# EAGLE schematic time-decoders (EAGLE 7.7.0)
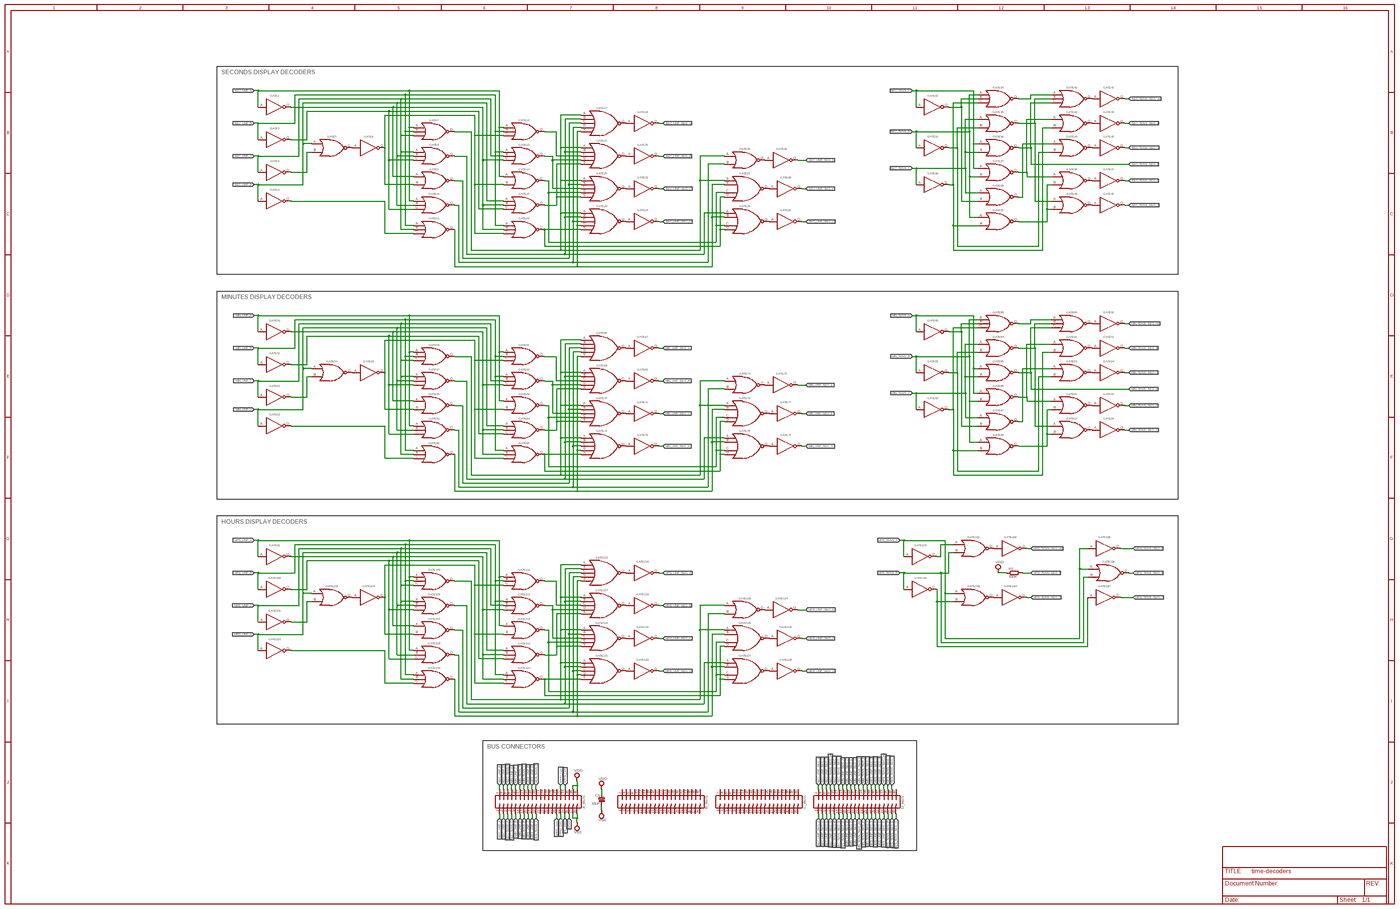
[diagram p0: schematic, sheet 1, overview]
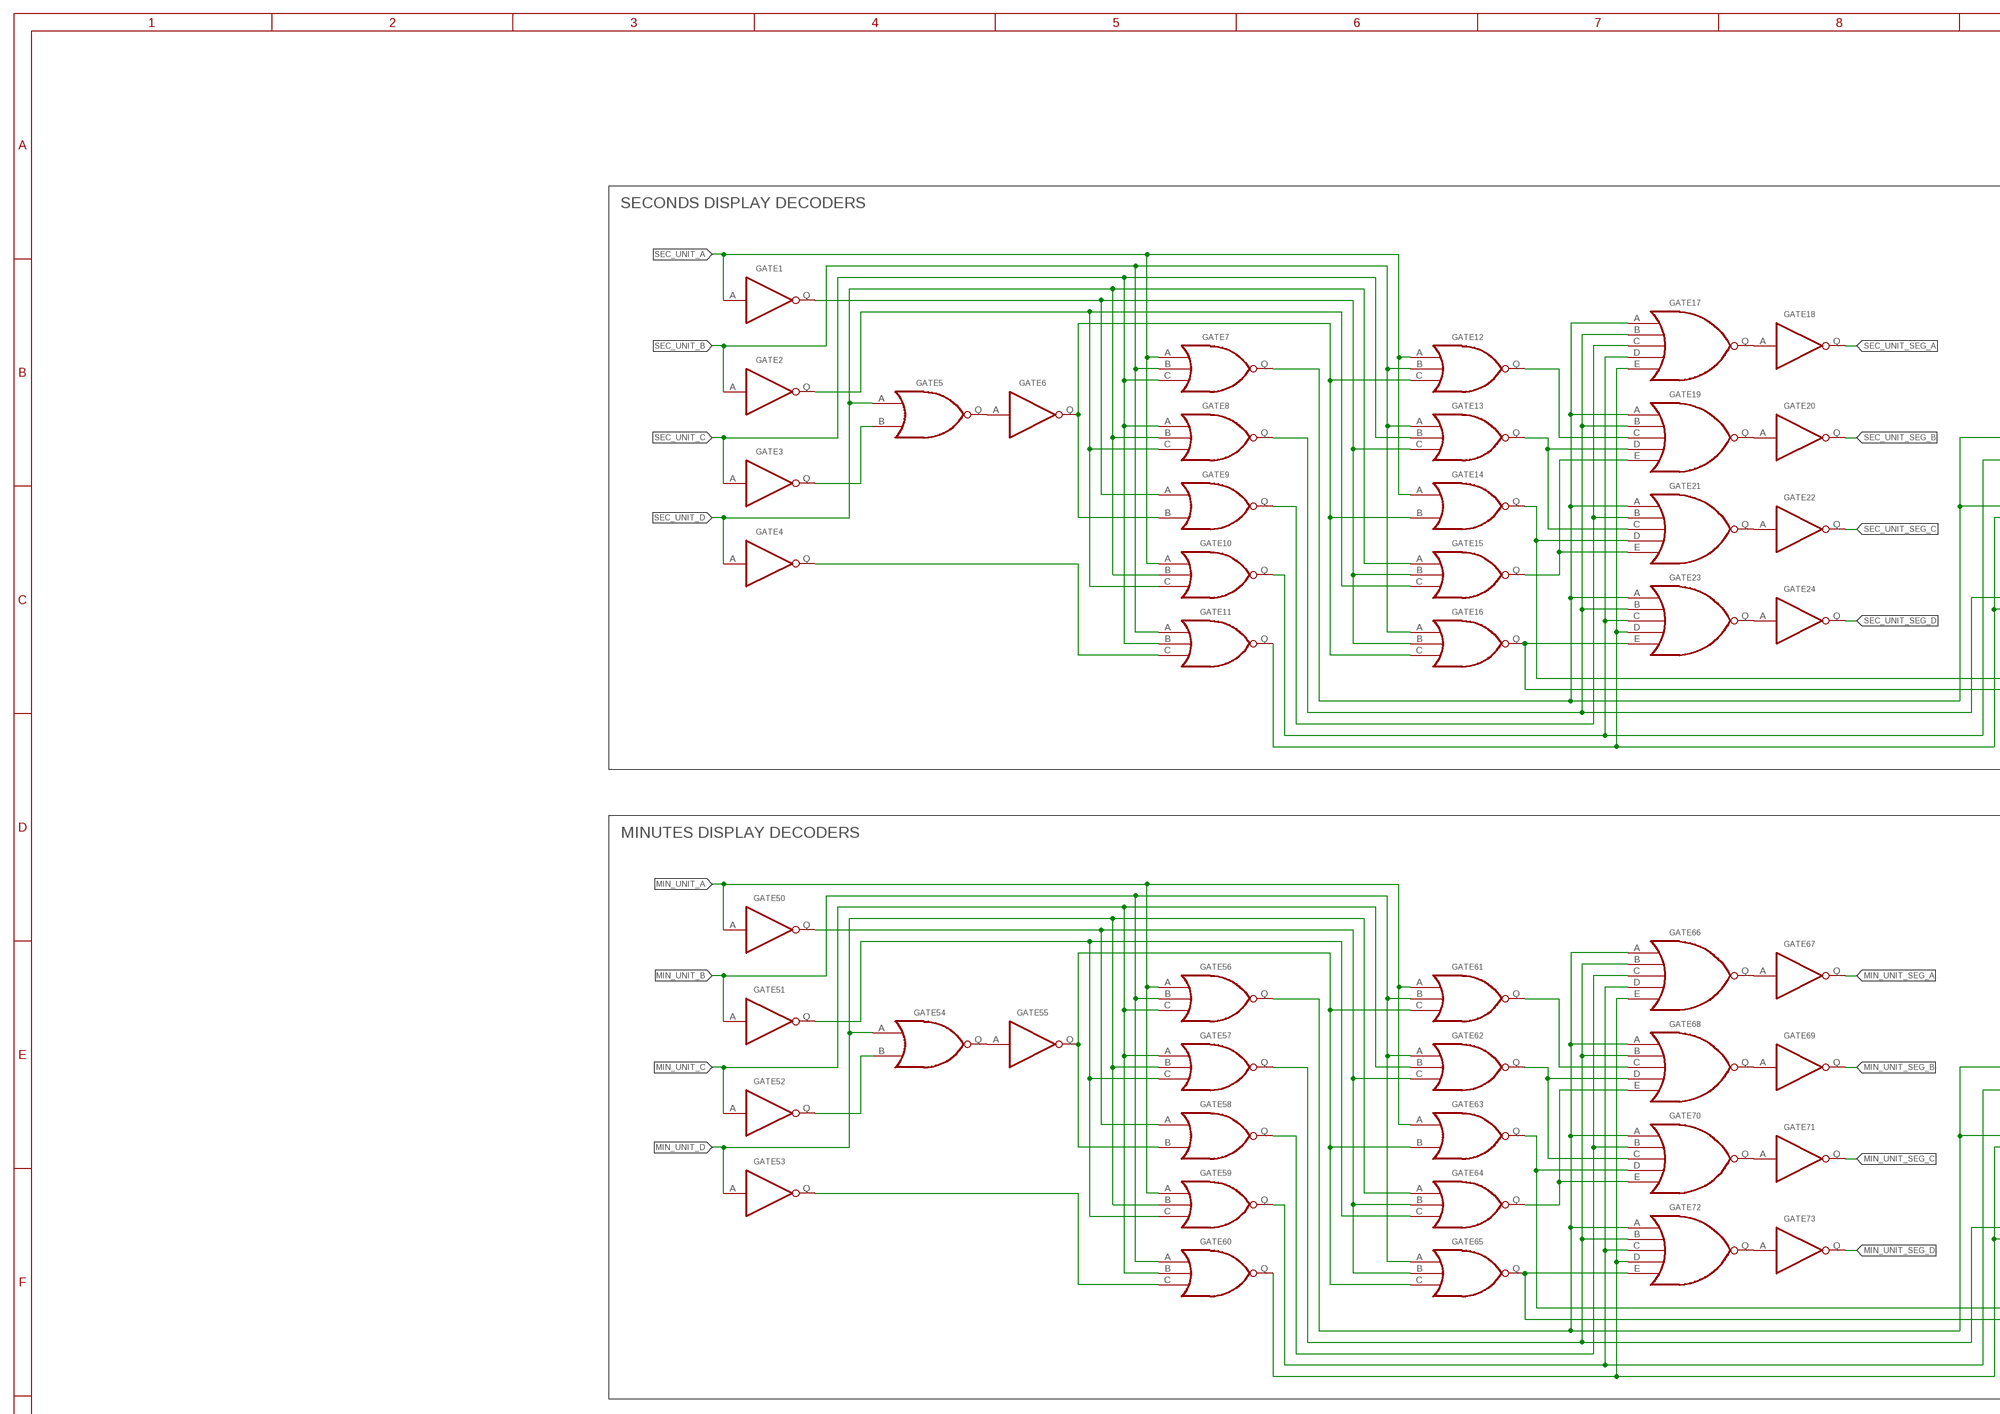
[diagram p1: schematic, sheet 1, part 1 of 4]
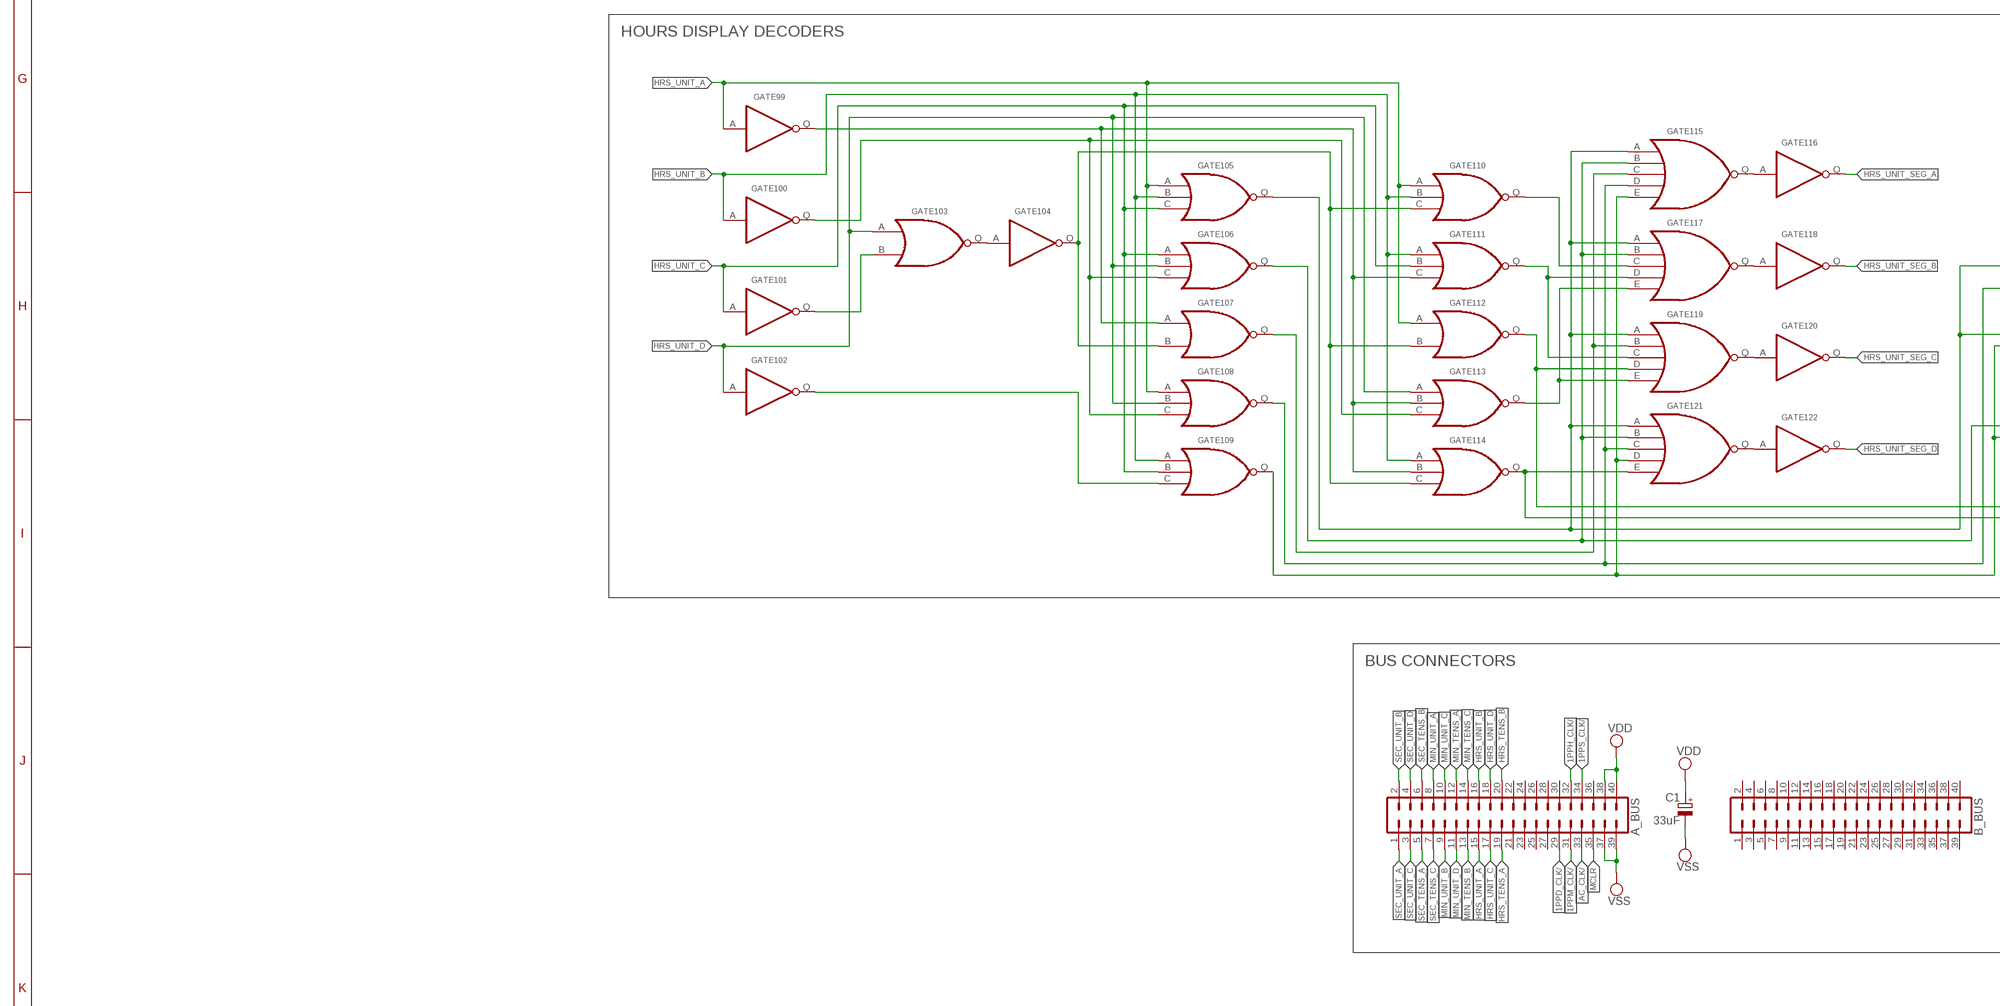
[diagram p2: schematic, sheet 1, part 2 of 4]
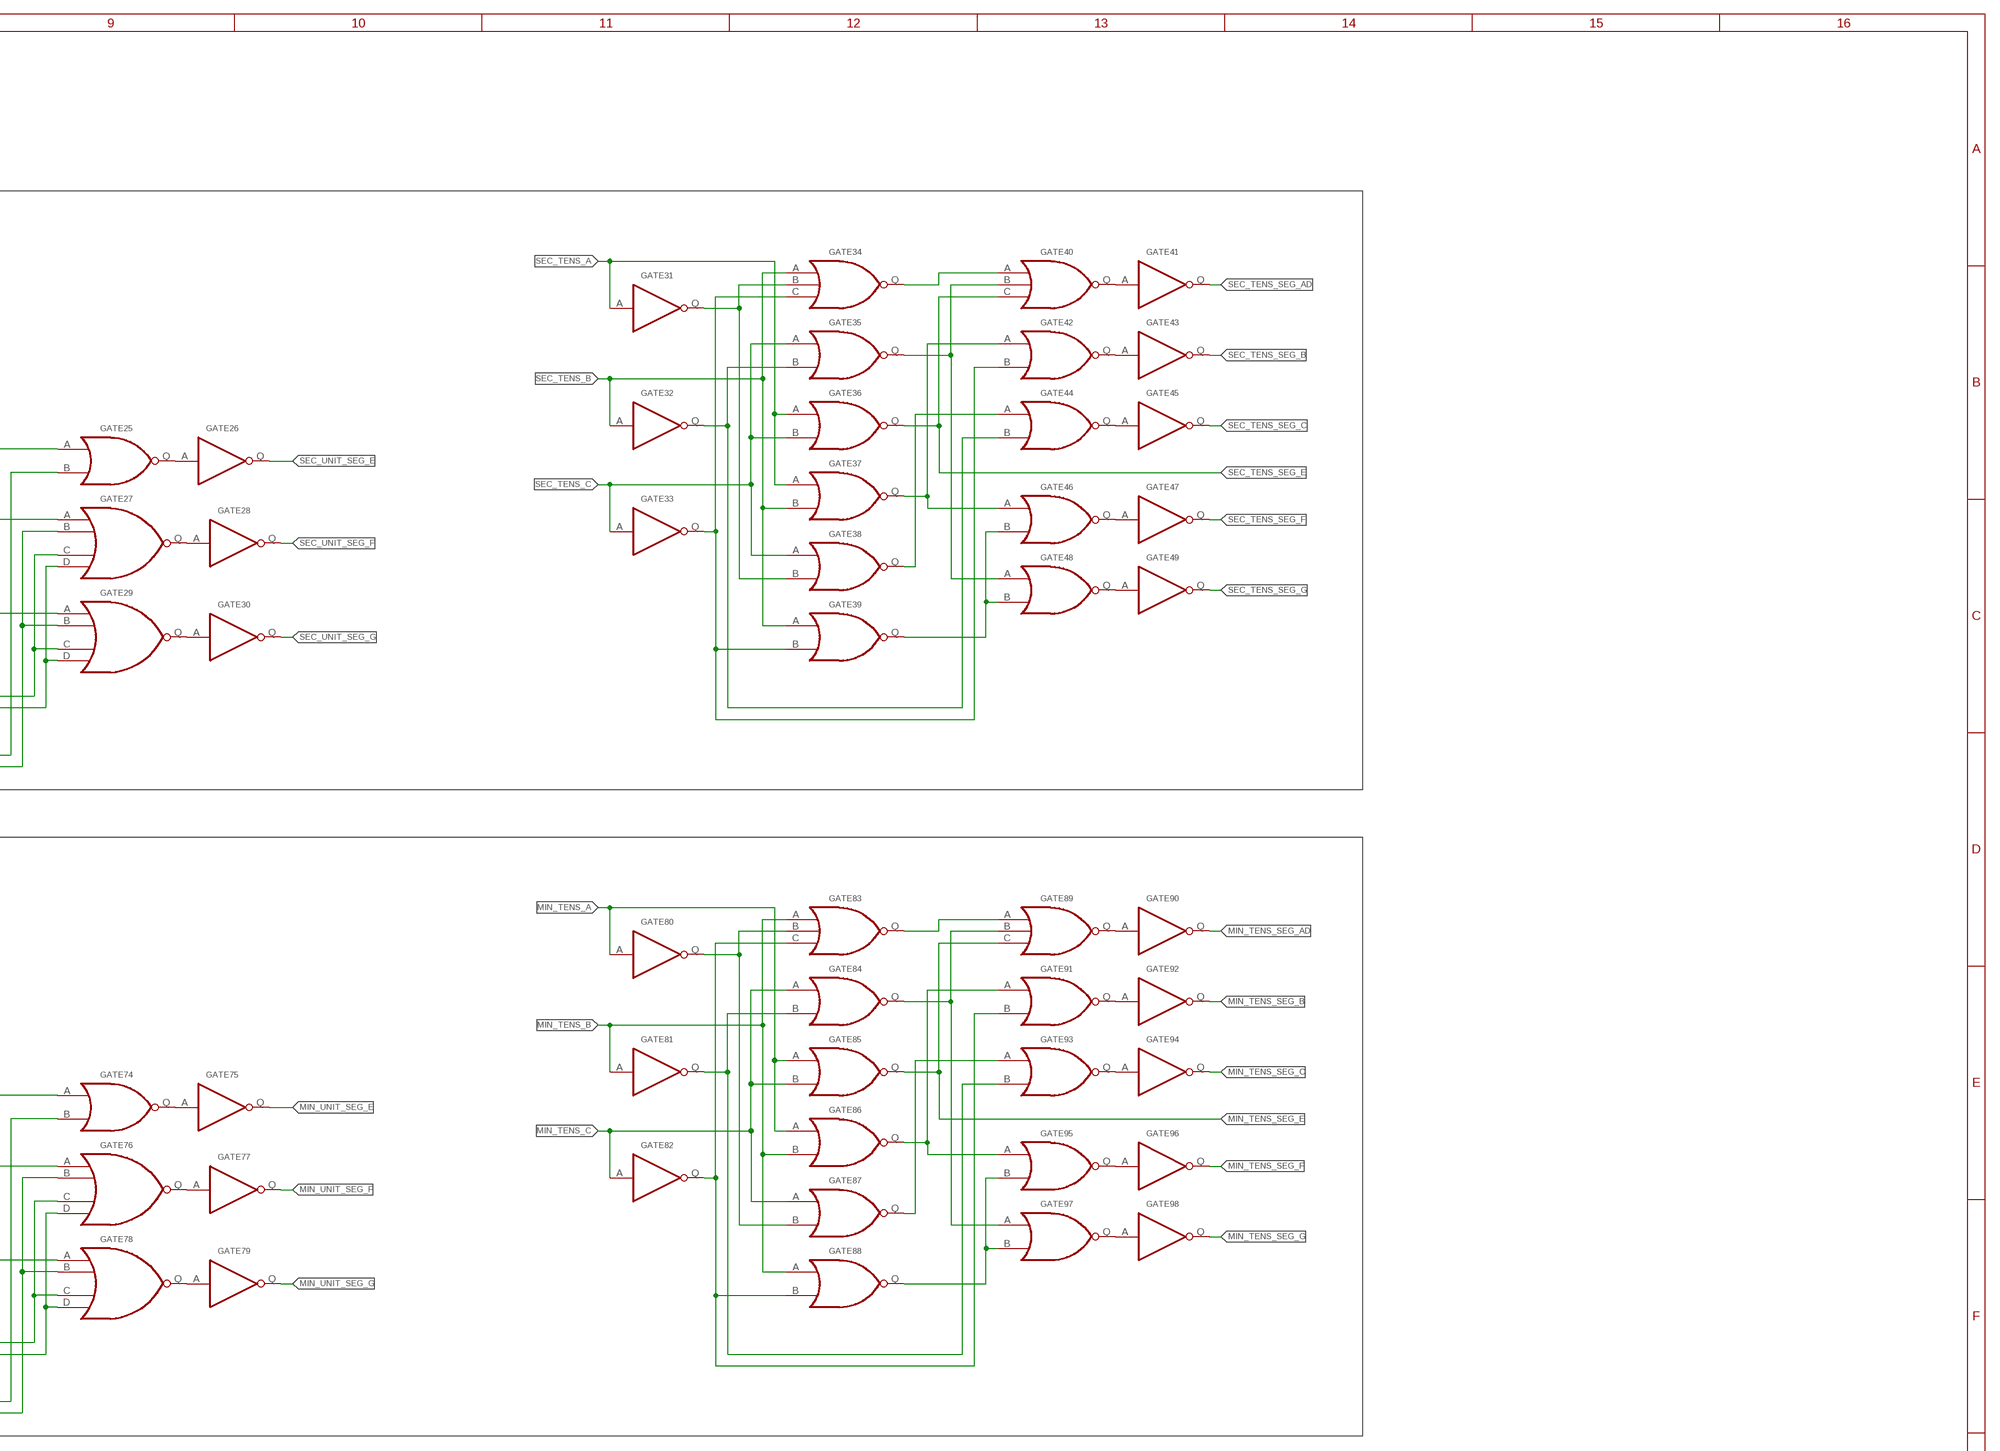
[diagram p3: schematic, sheet 1, part 3 of 4]
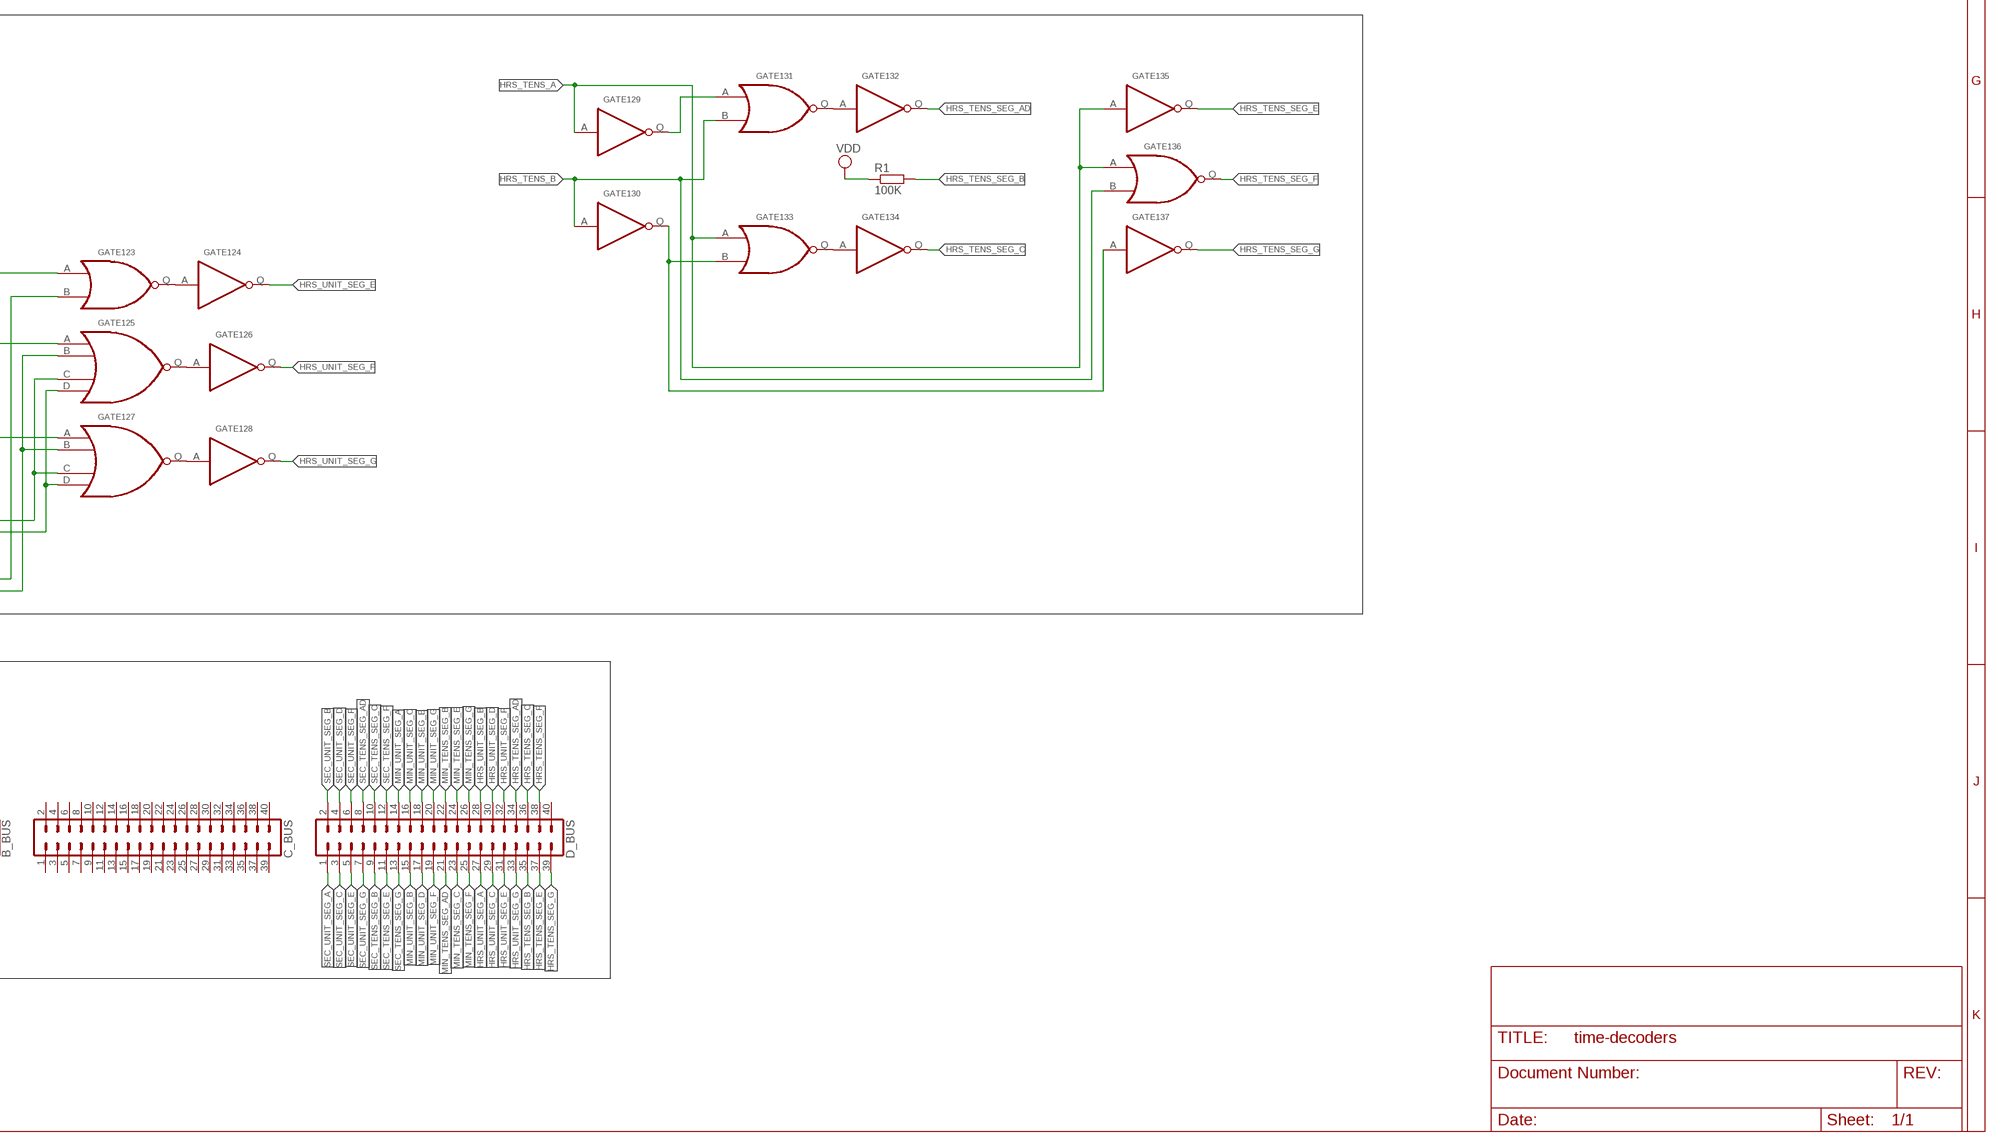
[diagram p4: schematic, sheet 1, part 4 of 4]

## Parts
A_BUS  MA20-2  [MA20-2]
B_BUS  MA20-2  [MA20-2]
C1  33uF  CPOL-EUE2.5-6  [E2,5-6]
C_BUS  MA20-2  [MA20-2]
D_BUS  MA20-2  [MA20-2]
GATE1  INVERTER  [INVERTER]
GATE2  INVERTER  [INVERTER]
GATE3  INVERTER  [INVERTER]
GATE4  INVERTER  [INVERTER]
GATE5  2NOR  [2NOR]
GATE6  INVERTER  [INVERTER]
GATE7  3NOR  [3NOR]
GATE8  3NOR  [3NOR]
GATE9  2NOR  [2NOR]
GATE10  3NOR  [3NOR]
GATE11  3NOR  [3NOR]
GATE12  3NOR  [3NOR]
GATE13  3NOR  [3NOR]
GATE14  2NOR  [2NOR]
GATE15  3NOR  [3NOR]
GATE16  3NOR  [3NOR]
GATE17  5NOR  [5NOR]
GATE18  INVERTER  [INVERTER]
GATE19  5NOR  [5NOR]
GATE20  INVERTER  [INVERTER]
GATE21  5NOR  [5NOR]
GATE22  INVERTER  [INVERTER]
GATE23  5NOR  [5NOR]
GATE24  INVERTER  [INVERTER]
GATE25  2NOR  [2NOR]
GATE26  INVERTER  [INVERTER]
GATE27  4NOR  [4NOR]
GATE28  INVERTER  [INVERTER]
GATE29  4NOR  [4NOR]
GATE30  INVERTER  [INVERTER]
GATE31  INVERTER  [INVERTER]
GATE32  INVERTER  [INVERTER]
GATE33  INVERTER  [INVERTER]
GATE34  3NOR  [3NOR]
GATE35  2NOR  [2NOR]
GATE36  2NOR  [2NOR]
GATE37  2NOR  [2NOR]
GATE38  2NOR  [2NOR]
GATE39  2NOR  [2NOR]
GATE40  3NOR  [3NOR]
GATE41  INVERTER  [INVERTER]
GATE42  2NOR  [2NOR]
GATE43  INVERTER  [INVERTER]
GATE44  2NOR  [2NOR]
GATE45  INVERTER  [INVERTER]
GATE46  2NOR  [2NOR]
GATE47  INVERTER  [INVERTER]
GATE48  2NOR  [2NOR]
GATE49  INVERTER  [INVERTER]
GATE50  INVERTER  [INVERTER]
GATE51  INVERTER  [INVERTER]
GATE52  INVERTER  [INVERTER]
GATE53  INVERTER  [INVERTER]
GATE54  2NOR  [2NOR]
GATE55  INVERTER  [INVERTER]
GATE56  3NOR  [3NOR]
GATE57  3NOR  [3NOR]
GATE58  2NOR  [2NOR]
GATE59  3NOR  [3NOR]
GATE60  3NOR  [3NOR]
GATE61  3NOR  [3NOR]
GATE62  3NOR  [3NOR]
GATE63  2NOR  [2NOR]
GATE64  3NOR  [3NOR]
GATE65  3NOR  [3NOR]
GATE66  5NOR  [5NOR]
GATE67  INVERTER  [INVERTER]
GATE68  5NOR  [5NOR]
GATE69  INVERTER  [INVERTER]
GATE70  5NOR  [5NOR]
GATE71  INVERTER  [INVERTER]
GATE72  5NOR  [5NOR]
GATE73  INVERTER  [INVERTER]
GATE74  2NOR  [2NOR]
GATE75  INVERTER  [INVERTER]
GATE76  4NOR  [4NOR]
GATE77  INVERTER  [INVERTER]
GATE78  4NOR  [4NOR]
GATE79  INVERTER  [INVERTER]
GATE80  INVERTER  [INVERTER]
GATE81  INVERTER  [INVERTER]
GATE82  INVERTER  [INVERTER]
GATE83  3NOR  [3NOR]
GATE84  2NOR  [2NOR]
GATE85  2NOR  [2NOR]
GATE86  2NOR  [2NOR]
GATE87  2NOR  [2NOR]
GATE88  2NOR  [2NOR]
GATE89  3NOR  [3NOR]
GATE90  INVERTER  [INVERTER]
GATE91  2NOR  [2NOR]
GATE92  INVERTER  [INVERTER]
GATE93  2NOR  [2NOR]
GATE94  INVERTER  [INVERTER]
GATE95  2NOR  [2NOR]
GATE96  INVERTER  [INVERTER]
GATE97  2NOR  [2NOR]
GATE98  INVERTER  [INVERTER]
GATE99  INVERTER  [INVERTER]
GATE100  INVERTER  [INVERTER]
GATE101  INVERTER  [INVERTER]
GATE102  INVERTER  [INVERTER]
GATE103  2NOR  [2NOR]
GATE104  INVERTER  [INVERTER]
GATE105  3NOR  [3NOR]
GATE106  3NOR  [3NOR]
GATE107  2NOR  [2NOR]
GATE108  3NOR  [3NOR]
GATE109  3NOR  [3NOR]
GATE110  3NOR  [3NOR]
GATE111  3NOR  [3NOR]
GATE112  2NOR  [2NOR]
GATE113  3NOR  [3NOR]
GATE114  3NOR  [3NOR]
GATE115  5NOR  [5NOR]
GATE116  INVERTER  [INVERTER]
GATE117  5NOR  [5NOR]
GATE118  INVERTER  [INVERTER]
GATE119  5NOR  [5NOR]
GATE120  INVERTER  [INVERTER]
GATE121  5NOR  [5NOR]
GATE122  INVERTER  [INVERTER]
GATE123  2NOR  [2NOR]
GATE124  INVERTER  [INVERTER]
GATE125  4NOR  [4NOR]
GATE126  INVERTER  [INVERTER]
GATE127  4NOR  [4NOR]
GATE128  INVERTER  [INVERTER]
GATE129  INVERTER  [INVERTER]
GATE130  INVERTER  [INVERTER]
GATE131  2NOR  [2NOR]
GATE132  INVERTER  [INVERTER]
GATE133  2NOR  [2NOR]
GATE134  INVERTER  [INVERTER]
GATE135  INVERTER  [INVERTER]
GATE136  2NOR  [2NOR]
GATE137  INVERTER  [INVERTER]
R1  100K  R-EU_0207/2V  [0207/2V]

## Nets
1PPD_CLK/: A_BUS.29
1PPH_CLK/: A_BUS.32
1PPM_CLK/: A_BUS.31
1PPS_CLK/: A_BUS.34
AC_CLK/: A_BUS.33
HRS_TENS_A: A_BUS.19 GATE129.A GATE133.A GATE135.A GATE136.A
HRS_TENS_B: A_BUS.20 GATE130.A GATE131.B GATE136.B
HRS_TENS_SEG_AD: D_BUS.34 GATE132.Q
HRS_TENS_SEG_B: D_BUS.35 R1.2
HRS_TENS_SEG_C: D_BUS.36 GATE134.Q
HRS_TENS_SEG_E: D_BUS.37 GATE135.Q
HRS_TENS_SEG_F: D_BUS.38 GATE136.Q
HRS_TENS_SEG_G: D_BUS.39 GATE137.Q
HRS_UNIT_A: A_BUS.15 GATE99.A GATE105.A GATE108.A GATE110.A GATE112.A
HRS_UNIT_B: A_BUS.16 GATE100.A GATE105.B GATE109.A GATE110.B GATE111.A GATE114.A
HRS_UNIT_C: A_BUS.17 GATE101.A GATE105.C GATE106.A GATE109.B GATE111.B
HRS_UNIT_D: A_BUS.18 GATE102.A GATE103.A GATE106.B GATE108.B GATE113.A
HRS_UNIT_SEG_A: D_BUS.27 GATE116.Q
HRS_UNIT_SEG_B: D_BUS.28 GATE118.Q
HRS_UNIT_SEG_C: D_BUS.29 GATE120.Q
HRS_UNIT_SEG_D: D_BUS.30 GATE122.Q
HRS_UNIT_SEG_E: D_BUS.31 GATE124.Q
HRS_UNIT_SEG_F: D_BUS.32 GATE126.Q
HRS_UNIT_SEG_G: D_BUS.33 GATE128.Q
MCLR: A_BUS.35
MIN_TENS_A: A_BUS.12 GATE80.A GATE85.A GATE86.A
MIN_TENS_B: A_BUS.13 GATE81.A GATE83.A GATE86.B GATE88.A
MIN_TENS_C: A_BUS.14 GATE82.A GATE84.A GATE85.B GATE87.A
MIN_TENS_SEG_AD: D_BUS.21 GATE90.Q
MIN_TENS_SEG_B: D_BUS.22 GATE92.Q
MIN_TENS_SEG_C: D_BUS.23 GATE94.Q
MIN_TENS_SEG_E: D_BUS.24 GATE85.Q GATE89.C
MIN_TENS_SEG_F: D_BUS.25 GATE96.Q
MIN_TENS_SEG_G: D_BUS.26 GATE98.Q
MIN_UNIT_A: A_BUS.8 GATE50.A GATE56.A GATE59.A GATE61.A GATE63.A
MIN_UNIT_B: A_BUS.9 GATE51.A GATE56.B GATE60.A GATE61.B GATE62.A GATE65.A
MIN_UNIT_C: A_BUS.10 GATE52.A GATE56.C GATE57.A GATE60.B GATE62.B
MIN_UNIT_D: A_BUS.11 GATE53.A GATE54.A GATE57.B GATE59.B GATE64.A
MIN_UNIT_SEG_A: D_BUS.14 GATE67.Q
MIN_UNIT_SEG_B: D_BUS.15 GATE69.Q
MIN_UNIT_SEG_C: D_BUS.16 GATE71.Q
MIN_UNIT_SEG_D: D_BUS.17 GATE73.Q
MIN_UNIT_SEG_E: D_BUS.18 GATE75.Q
MIN_UNIT_SEG_F: D_BUS.19 GATE77.Q
MIN_UNIT_SEG_G: D_BUS.20 GATE79.Q
N$1: GATE1.Q GATE9.A GATE13.C GATE15.B GATE16.B
N$2: GATE2.Q GATE8.C GATE10.C GATE15.C
N$3: GATE3.Q GATE5.B
N$4: GATE4.Q GATE11.C
N$5: GATE5.Q GATE6.A
N$6: GATE6.Q GATE9.B GATE12.C GATE14.B GATE16.C
N$7: GATE11.Q GATE17.E GATE23.D GATE27.B GATE29.B
N$8: GATE10.Q GATE17.D GATE23.C GATE25.B
N$9: GATE9.Q GATE17.C GATE21.B
N$10: GATE8.Q GATE17.B GATE19.B GATE23.B GATE29.A
N$11: GATE7.Q GATE17.A GATE19.A GATE21.A GATE23.A GATE25.A GATE27.A
N$12: GATE17.Q GATE18.A
N$13: GATE13.Q GATE19.D GATE21.C
N$14: GATE14.Q GATE21.D GATE27.C GATE29.C
N$15: GATE15.Q GATE19.E GATE21.E
N$16: GATE16.Q GATE23.E GATE27.D GATE29.D
N$17: GATE12.Q GATE19.C
N$18: GATE19.Q GATE20.A
N$19: GATE21.Q GATE22.A
N$20: GATE23.Q GATE24.A
N$21: GATE25.Q GATE26.A
N$22: GATE27.Q GATE28.A
N$23: GATE29.Q GATE30.A
N$24: GATE31.Q GATE34.B GATE38.B
N$25: GATE33.Q GATE34.C GATE39.B GATE42.B
N$26: GATE34.Q GATE40.A
N$27: GATE35.Q GATE40.B GATE48.A
N$28: GATE54.Q GATE55.A
N$29: GATE37.Q GATE42.A GATE46.A
N$30: GATE38.Q GATE44.A
N$31: GATE39.Q GATE46.B GATE48.B
N$32: GATE40.Q GATE41.A
N$33: GATE42.Q GATE43.A
N$34: GATE44.Q GATE45.A
N$35: GATE66.Q GATE67.A
N$36: GATE46.Q GATE47.A
N$37: GATE48.Q GATE49.A
N$38: GATE81.Q GATE84.B GATE93.B
N$39: GATE80.Q GATE83.B GATE87.B
N$40: GATE82.Q GATE83.C GATE88.B GATE91.B
N$41: GATE83.Q GATE89.A
N$42: GATE84.Q GATE89.B GATE97.A
N$43: GATE50.Q GATE58.A GATE62.C GATE64.B GATE65.B
N$44: GATE51.Q GATE57.C GATE59.C GATE64.C
N$45: GATE52.Q GATE54.B
N$46: GATE53.Q GATE60.C
N$47: GATE68.Q GATE69.A
N$48: GATE55.Q GATE58.B GATE61.C GATE63.B GATE65.C
N$49: GATE60.Q GATE66.E GATE72.D GATE76.B GATE78.B
N$50: GATE59.Q GATE66.D GATE72.C GATE74.B
N$51: GATE58.Q GATE66.C GATE70.B
N$52: GATE57.Q GATE66.B GATE68.B GATE72.B GATE78.A
N$53: GATE56.Q GATE66.A GATE68.A GATE70.A GATE72.A GATE74.A GATE76.A
N$54: GATE62.Q GATE68.D GATE70.C
N$55: GATE63.Q GATE70.D GATE76.C GATE78.C
N$56: GATE64.Q GATE68.E GATE70.E
N$57: GATE65.Q GATE72.E GATE76.D GATE78.D
N$58: GATE61.Q GATE68.C
N$59: GATE70.Q GATE71.A
N$60: GATE72.Q GATE73.A
N$61: GATE74.Q GATE75.A
N$62: GATE76.Q GATE77.A
N$63: GATE78.Q GATE79.A
N$64: GATE103.Q GATE104.A
N$65: GATE115.Q GATE116.A
N$66: GATE117.Q GATE118.A
N$67: GATE86.Q GATE91.A GATE95.A
N$68: GATE87.Q GATE93.A
N$69: GATE88.Q GATE95.B GATE97.B
N$70: GATE89.Q GATE90.A
N$71: GATE91.Q GATE92.A
N$72: GATE93.Q GATE94.A
N$73: GATE119.Q GATE120.A
N$74: GATE95.Q GATE96.A
N$75: GATE97.Q GATE98.A
N$76: GATE121.Q GATE122.A
N$77: GATE123.Q GATE124.A
N$78: GATE125.Q GATE126.A
N$79: GATE127.Q GATE128.A
N$85: GATE99.Q GATE107.A GATE111.C GATE113.B GATE114.B
N$86: GATE100.Q GATE106.C GATE108.C GATE113.C
N$87: GATE101.Q GATE103.B
N$88: GATE102.Q GATE109.C
N$90: GATE104.Q GATE107.B GATE110.C GATE112.B GATE114.C
N$91: GATE109.Q GATE115.E GATE121.D GATE125.B GATE127.B
N$92: GATE108.Q GATE115.D GATE121.C GATE123.B
N$93: GATE107.Q GATE115.C GATE119.B
N$94: GATE106.Q GATE115.B GATE117.B GATE121.B GATE127.A
N$95: GATE105.Q GATE115.A GATE117.A GATE119.A GATE121.A GATE123.A GATE125.A
N$96: GATE111.Q GATE117.D GATE119.C
N$97: GATE112.Q GATE119.D GATE125.C GATE127.C
N$98: GATE113.Q GATE117.E GATE119.E
N$99: GATE114.Q GATE121.E GATE125.D GATE127.D
N$100: GATE110.Q GATE117.C
N$108: GATE129.Q GATE131.A
N$109: GATE130.Q GATE133.B GATE137.A
N$110: GATE131.Q GATE132.A
N$112: GATE133.Q GATE134.A
N$119: GATE32.Q GATE35.B GATE44.B
SEC_TENS_A: A_BUS.5 GATE31.A GATE36.A GATE37.A
SEC_TENS_B: A_BUS.6 GATE32.A GATE34.A GATE37.B GATE39.A
SEC_TENS_C: A_BUS.7 GATE33.A GATE35.A GATE36.B GATE38.A
SEC_TENS_SEG_AD: D_BUS.8 GATE41.Q
SEC_TENS_SEG_B: D_BUS.9 GATE43.Q
SEC_TENS_SEG_C: D_BUS.10 GATE45.Q
SEC_TENS_SEG_E: D_BUS.11 GATE36.Q GATE40.C
SEC_TENS_SEG_F: D_BUS.12 GATE47.Q
SEC_TENS_SEG_G: D_BUS.13 GATE49.Q
SEC_UNIT_A: A_BUS.1 GATE1.A GATE7.A GATE10.A GATE12.A GATE14.A
SEC_UNIT_B: A_BUS.2 GATE2.A GATE7.B GATE11.A GATE12.B GATE13.A GATE16.A
SEC_UNIT_C: A_BUS.3 GATE3.A GATE7.C GATE8.A GATE11.B GATE13.B
SEC_UNIT_D: A_BUS.4 GATE4.A GATE5.A GATE8.B GATE10.B GATE15.A
SEC_UNIT_SEG_A: D_BUS.1 GATE18.Q
SEC_UNIT_SEG_B: D_BUS.2 GATE20.Q
SEC_UNIT_SEG_C: D_BUS.3 GATE22.Q
SEC_UNIT_SEG_D: D_BUS.4 GATE24.Q
SEC_UNIT_SEG_E: D_BUS.5 GATE26.Q
SEC_UNIT_SEG_F: D_BUS.6 GATE28.Q
SEC_UNIT_SEG_G: D_BUS.7 GATE30.Q
VDD: A_BUS.38 A_BUS.40 C1.+ R1.1
VSS: A_BUS.37 A_BUS.39 C1.-
Unconnected: A_BUS.21 A_BUS.22 A_BUS.23 A_BUS.24 A_BUS.25 A_BUS.26 A_BUS.27 A_BUS.28 A_BUS.30 A_BUS.36 B_BUS.1 B_BUS.2 B_BUS.3 B_BUS.4 B_BUS.5 B_BUS.6 B_BUS.7 B_BUS.8 B_BUS.9 B_BUS.10 B_BUS.11 B_BUS.12 B_BUS.13 B_BUS.14 B_BUS.15 B_BUS.16 B_BUS.17 B_BUS.18 B_BUS.19 B_BUS.20 B_BUS.21 B_BUS.22 B_BUS.23 B_BUS.24 B_BUS.25 B_BUS.26 B_BUS.27 B_BUS.28 B_BUS.29 B_BUS.30 B_BUS.31 B_BUS.32 B_BUS.33 B_BUS.34 B_BUS.35 B_BUS.36 B_BUS.37 B_BUS.38 B_BUS.39 B_BUS.40 C_BUS.1 C_BUS.2 C_BUS.3 C_BUS.4 C_BUS.5 C_BUS.6 C_BUS.7 C_BUS.8 C_BUS.9 C_BUS.10 C_BUS.11 C_BUS.12 C_BUS.13 C_BUS.14 C_BUS.15 C_BUS.16 C_BUS.17 C_BUS.18 C_BUS.19 C_BUS.20 C_BUS.21 C_BUS.22 C_BUS.23 C_BUS.24 C_BUS.25 C_BUS.26 C_BUS.27 C_BUS.28 C_BUS.29 C_BUS.30 C_BUS.31 C_BUS.32 C_BUS.33 C_BUS.34 C_BUS.35 C_BUS.36 C_BUS.37 C_BUS.38 C_BUS.39 C_BUS.40 D_BUS.40

## Notes on the sheet
- SECONDS DISPLAY DECODERS
- MINUTES DISPLAY DECODERS
- HOURS DISPLAY DECODERS
- BUS CONNECTORS

## Library data of the parts
A_BUS B_BUS C_BUS D_BUS = con-lstb:MA20-2: PIN HEADER; OC_FARNELL: unknown; OC_NEWARK: unknown
C1 = rcl:CPOL-EU: POLARIZED CAPACITOR, European symbol
GATE1-GATE4 GATE6 GATE18 GATE20 GATE22 GATE24 GATE26 GATE28 GATE30-GATE33 GATE41 GATE43 GATE45 GATE47 GATE49-GATE53 GATE55 GATE67 GATE69 GATE71 GATE73 GATE75 GATE77 GATE79-GATE82 GATE90 GATE92 GATE94 GATE96 GATE98-GATE102 GATE104 GATE116 GATE118 GATE120 GATE122 GATE124 GATE126 GATE128-GATE130 GATE132 GATE134 GATE135 GATE137 = NOR gate clock:INVERTER
GATE5 GATE9 GATE14 GATE25 GATE35-GATE39 GATE42 GATE44 GATE46 GATE48 GATE54 GATE58 GATE63 GATE74 GATE84-GATE88 GATE91 GATE93 GATE95 GATE97 GATE103 GATE107 GATE112 GATE123 GATE131 GATE133 GATE136 = NOR gate clock:2NOR
GATE7 GATE8 GATE10-GATE13 GATE15 GATE16 GATE34 GATE40 GATE56 GATE57 GATE59-GATE62 GATE64 GATE65 GATE83 GATE89 GATE105 GATE106 GATE108-GATE111 GATE113 GATE114 = NOR gate clock:3NOR
GATE17 GATE19 GATE21 GATE23 GATE66 GATE68 GATE70 GATE72 GATE115 GATE117 GATE119 GATE121 = NOR gate clock:5NOR
GATE27 GATE29 GATE76 GATE78 GATE125 GATE127 = NOR gate clock:4NOR
R1 = NOR gate clock:R-EU_